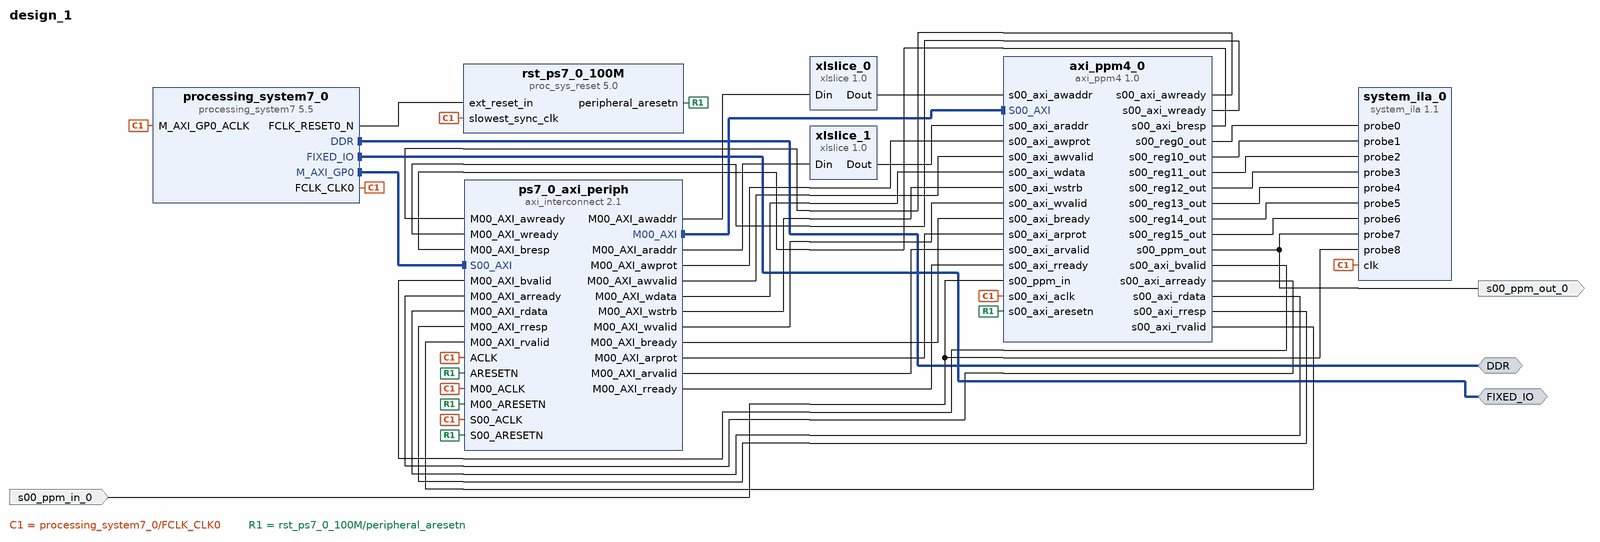
[diagram p0: block diagram of the top level]
# Vivado block design design_1, xc7z020clg484-1, Vivado 2020.1
create_bd_design design_1

create_bd_intf_port -mode Master -vlnv xilinx.com:interface:ddrx_rtl:1.0 DDR
create_bd_intf_port -mode Master -vlnv xilinx.com:display_processing_system7:fixedio_rtl:1.0 FIXED_IO
create_bd_port -dir I s00_ppm_in_0
create_bd_port -dir O s00_ppm_out_0

create_bd_cell -type ip -vlnv xilinx.com:ip:processing_system7:5.5 processing_system7_0
set_property -dict [list \
  CONFIG.PCW_APU_PERIPHERAL_FREQMHZ 666.666667 \
  CONFIG.PCW_ENET0_ENET0_IO {MIO 16 .. 27} \
  CONFIG.PCW_ENET0_GRP_MDIO_ENABLE 1 \
  CONFIG.PCW_ENET0_GRP_MDIO_IO {MIO 52 .. 53} \
  CONFIG.PCW_ENET0_PERIPHERAL_ENABLE 1 \
  CONFIG.PCW_ENET0_RESET_ENABLE 0 \
  CONFIG.PCW_ENET_RESET_ENABLE 1 \
  CONFIG.PCW_ENET_RESET_SELECT {Share reset pin} \
  CONFIG.PCW_FPGA0_PERIPHERAL_FREQMHZ 100.000000 \
  CONFIG.PCW_FPGA1_PERIPHERAL_FREQMHZ 150.000000 \
  CONFIG.PCW_GPIO_MIO_GPIO_ENABLE 1 \
  CONFIG.PCW_GPIO_MIO_GPIO_IO MIO \
  CONFIG.PCW_I2C_RESET_ENABLE 1 \
  CONFIG.PCW_PRESET_BANK1_VOLTAGE {LVCMOS 1.8V} \
  CONFIG.PCW_QSPI_GRP_SINGLE_SS_ENABLE 1 \
  CONFIG.PCW_QSPI_GRP_SINGLE_SS_IO {MIO 1 .. 6} \
  CONFIG.PCW_QSPI_PERIPHERAL_ENABLE 1 \
  CONFIG.PCW_QSPI_QSPI_IO {MIO 1 .. 6} \
  CONFIG.PCW_SD0_GRP_CD_ENABLE 1 \
  CONFIG.PCW_SD0_GRP_CD_IO {MIO 47} \
  CONFIG.PCW_SD0_GRP_WP_ENABLE 1 \
  CONFIG.PCW_SD0_GRP_WP_IO {MIO 46} \
  CONFIG.PCW_SD0_PERIPHERAL_ENABLE 1 \
  CONFIG.PCW_SD0_SD0_IO {MIO 40 .. 45} \
  CONFIG.PCW_SDIO_PERIPHERAL_FREQMHZ 50 \
  CONFIG.PCW_SINGLE_QSPI_DATA_MODE x4 \
  CONFIG.PCW_TTC0_PERIPHERAL_ENABLE 1 \
  CONFIG.PCW_TTC0_TTC0_IO EMIO \
  CONFIG.PCW_UART1_PERIPHERAL_ENABLE 1 \
  CONFIG.PCW_UART1_UART1_IO {MIO 48 .. 49} \
  CONFIG.PCW_UART_PERIPHERAL_FREQMHZ 50 \
  CONFIG.PCW_UIPARAM_DDR_FREQ_MHZ 533.333313 \
  CONFIG.PCW_UIPARAM_DDR_PARTNO {MT41J128M16 HA-15E} \
  CONFIG.PCW_USB0_PERIPHERAL_ENABLE 1 \
  CONFIG.PCW_USB0_RESET_ENABLE 0 \
  CONFIG.PCW_USB0_USB0_IO {MIO 28 .. 39} \
  CONFIG.PCW_USB_RESET_ENABLE 1 \
  CONFIG.PCW_USB_RESET_SELECT {Share reset pin} \
  CONFIG.preset ZedBoard \
] [get_bd_cells processing_system7_0]
# 223 more settings of processing_system7_0 are not shown: defaults, MIO pin electricals, DDR timing, and values the tool derives
create_bd_cell -type ip -vlnv xilinx.com:ip:axi_interconnect:2.1 ps7_0_axi_periph
set_property -dict {CONFIG.NUM_MI 1} [get_bd_cells ps7_0_axi_periph]
create_bd_cell -type ip -vlnv xilinx.com:ip:proc_sys_reset:5.0 rst_ps7_0_100M
create_bd_cell -type ip -vlnv xilinx.com:ip:xlslice:1.0 xlslice_0
set_property -dict {CONFIG.DIN_FROM 5 CONFIG.DIN_TO 0 CONFIG.DOUT_WIDTH 6} [get_bd_cells xlslice_0]
create_bd_cell -type ip -vlnv xilinx.com:ip:xlslice:1.0 xlslice_1
set_property -dict {CONFIG.DIN_FROM 5 CONFIG.DIN_TO 0 CONFIG.DOUT_WIDTH 6} [get_bd_cells xlslice_1]
create_bd_cell -type ip -vlnv xilinx.com:ip:system_ila:1.1 system_ila_0
set_property -dict [list \
  CONFIG.C_DATA_DEPTH 4096 \
  CONFIG.C_MON_TYPE NATIVE \
  CONFIG.C_NUM_OF_PROBES 9 \
  CONFIG.C_PROBE0_TYPE 0 \
  CONFIG.C_PROBE0_WIDTH 32 \
  CONFIG.C_PROBE1_TYPE 0 \
  CONFIG.C_PROBE1_WIDTH 32 \
  CONFIG.C_PROBE2_TYPE 0 \
  CONFIG.C_PROBE2_WIDTH 32 \
  CONFIG.C_PROBE3_TYPE 0 \
  CONFIG.C_PROBE3_WIDTH 32 \
  CONFIG.C_PROBE4_TYPE 0 \
  CONFIG.C_PROBE4_WIDTH 32 \
  CONFIG.C_PROBE5_TYPE 0 \
  CONFIG.C_PROBE5_WIDTH 32 \
  CONFIG.C_PROBE6_TYPE 0 \
  CONFIG.C_PROBE6_WIDTH 32 \
  CONFIG.C_PROBE_WIDTH_PROPAGATION MANUAL \
] [get_bd_cells system_ila_0]
create_bd_cell -type ip -vlnv iastate.edu:user:axi_ppm4:1.0 axi_ppm4_0

# ---- connections ----

connect_bd_intf_net [get_bd_intf_pins ps7_0_axi_periph/M00_AXI] [get_bd_intf_pins axi_ppm4_0/S00_AXI]
connect_bd_intf_net [get_bd_intf_pins processing_system7_0/M_AXI_GP0] [get_bd_intf_pins ps7_0_axi_periph/S00_AXI]
connect_bd_intf_net [get_bd_intf_ports DDR] [get_bd_intf_pins processing_system7_0/DDR]
connect_bd_intf_net [get_bd_intf_ports FIXED_IO] [get_bd_intf_pins processing_system7_0/FIXED_IO]
connect_bd_net [get_bd_pins processing_system7_0/FCLK_CLK0] \
  [get_bd_pins processing_system7_0/M_AXI_GP0_ACLK] [get_bd_pins ps7_0_axi_periph/S00_ACLK] \
  [get_bd_pins rst_ps7_0_100M/slowest_sync_clk] [get_bd_pins ps7_0_axi_periph/M00_ACLK] [get_bd_pins ps7_0_axi_periph/ACLK] \
  [get_bd_pins system_ila_0/clk] [get_bd_pins axi_ppm4_0/s00_axi_aclk]
connect_bd_net [get_bd_pins processing_system7_0/FCLK_RESET0_N] [get_bd_pins rst_ps7_0_100M/ext_reset_in]
connect_bd_net [get_bd_pins rst_ps7_0_100M/peripheral_aresetn] \
  [get_bd_pins ps7_0_axi_periph/S00_ARESETN] [get_bd_pins ps7_0_axi_periph/M00_ARESETN] \
  [get_bd_pins ps7_0_axi_periph/ARESETN] [get_bd_pins axi_ppm4_0/s00_axi_aresetn]
connect_bd_net [get_bd_pins axi_ppm4_0/s00_ppm_out] [get_bd_ports s00_ppm_out_0] [get_bd_pins system_ila_0/probe7]
connect_bd_net [get_bd_pins ps7_0_axi_periph/M00_AXI_awaddr] [get_bd_pins xlslice_0/Din]
connect_bd_net [get_bd_pins xlslice_0/Dout] [get_bd_pins axi_ppm4_0/s00_axi_awaddr]
connect_bd_net [get_bd_pins ps7_0_axi_periph/M00_AXI_awprot] [get_bd_pins axi_ppm4_0/s00_axi_awprot]
connect_bd_net [get_bd_pins ps7_0_axi_periph/M00_AXI_awvalid] [get_bd_pins axi_ppm4_0/s00_axi_awvalid]
connect_bd_net -net M00_AXI_awready_1 [get_bd_pins axi_ppm4_0/s00_axi_awready] [get_bd_pins ps7_0_axi_periph/M00_AXI_awready]
connect_bd_net [get_bd_pins ps7_0_axi_periph/M00_AXI_wdata] [get_bd_pins axi_ppm4_0/s00_axi_wdata]
connect_bd_net [get_bd_pins ps7_0_axi_periph/M00_AXI_wstrb] [get_bd_pins axi_ppm4_0/s00_axi_wstrb]
connect_bd_net [get_bd_pins ps7_0_axi_periph/M00_AXI_wvalid] [get_bd_pins axi_ppm4_0/s00_axi_wvalid]
connect_bd_net -net M00_AXI_wready_1 [get_bd_pins axi_ppm4_0/s00_axi_wready] [get_bd_pins ps7_0_axi_periph/M00_AXI_wready]
connect_bd_net -net M00_AXI_bresp_1 [get_bd_pins axi_ppm4_0/s00_axi_bresp] [get_bd_pins ps7_0_axi_periph/M00_AXI_bresp]
connect_bd_net -net M00_AXI_bvalid_1 [get_bd_pins axi_ppm4_0/s00_axi_bvalid] [get_bd_pins ps7_0_axi_periph/M00_AXI_bvalid]
connect_bd_net [get_bd_pins ps7_0_axi_periph/M00_AXI_bready] [get_bd_pins axi_ppm4_0/s00_axi_bready]
connect_bd_net [get_bd_pins ps7_0_axi_periph/M00_AXI_araddr] [get_bd_pins xlslice_1/Din]
connect_bd_net [get_bd_pins xlslice_1/Dout] [get_bd_pins axi_ppm4_0/s00_axi_araddr]
connect_bd_net [get_bd_pins ps7_0_axi_periph/M00_AXI_arprot] [get_bd_pins axi_ppm4_0/s00_axi_arprot]
connect_bd_net [get_bd_pins ps7_0_axi_periph/M00_AXI_arvalid] [get_bd_pins axi_ppm4_0/s00_axi_arvalid]
connect_bd_net -net M00_AXI_arready_1 [get_bd_pins axi_ppm4_0/s00_axi_arready] [get_bd_pins ps7_0_axi_periph/M00_AXI_arready]
connect_bd_net -net M00_AXI_rdata_1 [get_bd_pins axi_ppm4_0/s00_axi_rdata] [get_bd_pins ps7_0_axi_periph/M00_AXI_rdata]
connect_bd_net -net M00_AXI_rresp_1 [get_bd_pins axi_ppm4_0/s00_axi_rresp] [get_bd_pins ps7_0_axi_periph/M00_AXI_rresp]
connect_bd_net -net M00_AXI_rvalid_1 [get_bd_pins axi_ppm4_0/s00_axi_rvalid] [get_bd_pins ps7_0_axi_periph/M00_AXI_rvalid]
connect_bd_net [get_bd_pins ps7_0_axi_periph/M00_AXI_rready] [get_bd_pins axi_ppm4_0/s00_axi_rready]
connect_bd_net -net ppm_in_0_1 [get_bd_ports s00_ppm_in_0] [get_bd_pins system_ila_0/probe8] [get_bd_pins axi_ppm4_0/s00_ppm_in]
connect_bd_net -net s00_reg0_out [get_bd_pins axi_ppm4_0/s00_reg0_out] [get_bd_pins system_ila_0/probe0]
connect_bd_net -net s00_reg10_out [get_bd_pins axi_ppm4_0/s00_reg10_out] [get_bd_pins system_ila_0/probe1]
connect_bd_net -net s00_reg11_out [get_bd_pins axi_ppm4_0/s00_reg11_out] [get_bd_pins system_ila_0/probe2]
connect_bd_net -net s00_reg12_out [get_bd_pins axi_ppm4_0/s00_reg12_out] [get_bd_pins system_ila_0/probe3]
connect_bd_net -net s00_reg13_out [get_bd_pins axi_ppm4_0/s00_reg13_out] [get_bd_pins system_ila_0/probe4]
connect_bd_net -net s00_reg14_out [get_bd_pins axi_ppm4_0/s00_reg14_out] [get_bd_pins system_ila_0/probe5]
connect_bd_net -net s00_reg15_out [get_bd_pins axi_ppm4_0/s00_reg15_out] [get_bd_pins system_ila_0/probe6]
set_property HDL_ATTRIBUTE.DEBUG true [get_bd_nets s00_reg0_out]
set_property HDL_ATTRIBUTE.MARK_DEBUG true [get_bd_nets s00_reg0_out]
set_property HDL_ATTRIBUTE.DEBUG true [get_bd_nets s00_reg10_out]
set_property HDL_ATTRIBUTE.MARK_DEBUG true [get_bd_nets s00_reg10_out]
set_property HDL_ATTRIBUTE.DEBUG true [get_bd_nets s00_reg11_out]
set_property HDL_ATTRIBUTE.MARK_DEBUG true [get_bd_nets s00_reg11_out]
set_property HDL_ATTRIBUTE.DEBUG true [get_bd_nets s00_reg12_out]
set_property HDL_ATTRIBUTE.MARK_DEBUG true [get_bd_nets s00_reg12_out]
set_property HDL_ATTRIBUTE.DEBUG true [get_bd_nets s00_reg13_out]
set_property HDL_ATTRIBUTE.MARK_DEBUG true [get_bd_nets s00_reg13_out]
set_property HDL_ATTRIBUTE.DEBUG true [get_bd_nets s00_reg14_out]
set_property HDL_ATTRIBUTE.MARK_DEBUG true [get_bd_nets s00_reg14_out]
set_property HDL_ATTRIBUTE.DEBUG true [get_bd_nets s00_reg15_out]
set_property HDL_ATTRIBUTE.MARK_DEBUG true [get_bd_nets s00_reg15_out]

# ---- address map ----
assign_bd_address -offset 0x43C00000 -range 64K -target_address_space [get_bd_addr_spaces processing_system7_0/Data] [get_bd_addr_segs axi_ppm4_0/S00_AXI/S00_AXI_reg]

validate_bd_design
save_bd_design
